# EAGLE schematic optcircuit (EAGLE 7.5.0)
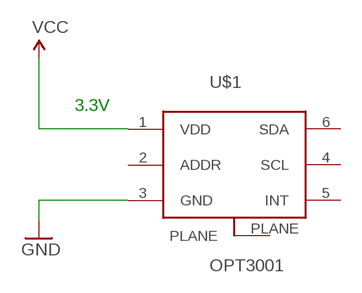
[diagram p0: schematic, sheet 1]

## Parts
U$1  OPT3001  [OPT3001]

## Nets
3.3V: U$1.1(VDD) ; supply symbol labelled VCC
Unconnected: U$1.2(ADDR) U$1.4(SCL) U$1.5(INT) U$1.6(SDA) U$1.PLANE

## Notes on the sheet
- 3.3V

## Power pins joined to a net without a drawn wire
GND: U$1.3(GND)

## Library data of the parts
U$1 = datchiki:OPT3001